# EasyEDA Pro project 遥控器PCB设计.eprj, schematic Schematic1
Board Name: 遥控器_4通道_完整版; Create Date: 2025-07-09; Page Name: P1; Project Name: 遥控器PCB设计; Schematic Name: Schematic1; Update Date: 2025-07-14; Company: 嘉立创EDA; Page Size: A4; Version: V1.0
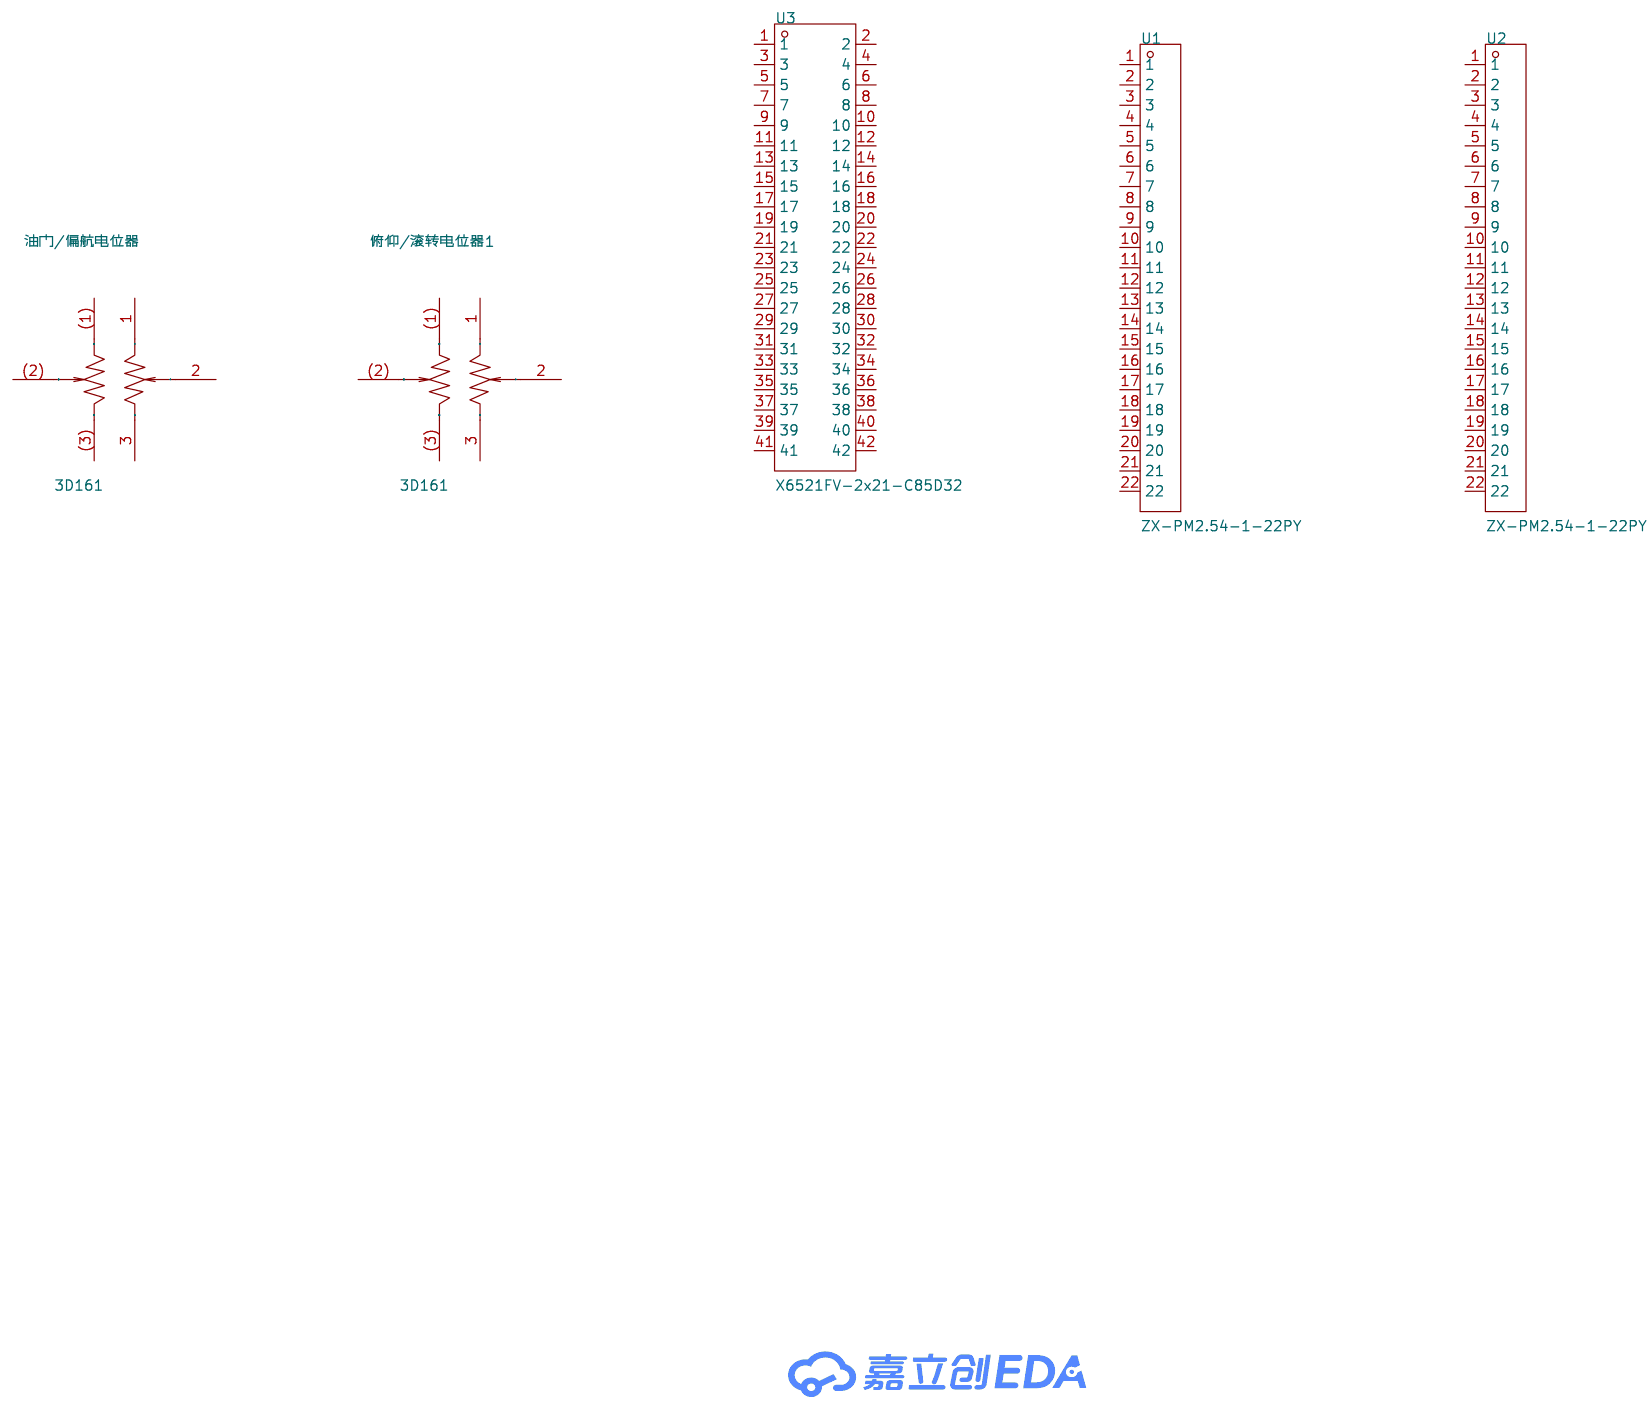
[diagram p8: schematic sheet]

## Parts
U1  ZX-PM2.54-1-22PY  [HDR-TH_22P-P2.54-V-F]
U2  ZX-PM2.54-1-22PY  [HDR-TH_22P-P2.54-V-F]
U3  X6521FV-2x21-C85D32  [HDR-TH_42P-P2.54-V-F-R2-C21-S2.54]
俯仰/滚转电位器1  3D161  [SW-TH_3D161]
油门/偏航电位器  3D161  [SW-TH_3D161]

## Library data of the parts
U1 U2 = ZX-PM2.54-1-22PY: LCSC Part Name: 1x22P 间距:2.54mm 直插; Supplier Part: C7499337; Manufacturer: Megastar(兆星); Supplier Footprint: 插件,P=2.54mm; JLCPCB Part Class: 扩展库; Datasheet: https://atta.szlcsc.com/upload/public/pdf/source/20231122/9A7AD1561672B326C4FDCF441604BC5A.pdf; Supplier: LCSC; Holes Structure: 1x22P; Pitch: 2.54mm; Circular Hole / Square Hole: 方孔; Mounting Type: 直插; Number of Rows: 单排; Number of Positions: 22P; Current Rating: 3A; Holes Direction: 顶部; Insulation Height: 8.5mm; Contact Plating: 金; Operating Temperature: -40℃~+105℃; PIN Length: 3.2mm
U3 = X6521FV-2X21-C85D32: 间距:2.54mm;总孔位数:42;排数:2;插孔结构:2x21P;行距:2.54mm;安装类型:直插;圆孔/方孔:方孔;额定电流:3A;额定电压:250V;插孔方向:顶部;塑高:8.5mm;触头材质:黄铜;触头镀层:金;工作温度范围:-40℃~+105℃;焊接温度(最大值):260℃;; LCSC Part Name: 2.54mm 2x21P; Supplier Part: C2883994; Manufacturer: XKB Connectivity(中国星坤); Supplier Footprint: 插件,P=2.54mm; Datasheet: https://atta.szlcsc.com/upload/public/pdf/source/20211009/C636DBF0733662F7F428F4420CCBBD46.pdf; Supplier: LCSC; Pitch: 2.54mm; Number of Holes: 42; Number of Rows: 2; Holes Structure: 2x21P; Row Spacing: 2.54mm; Mounting Type: 直插; Circular Hole / Square Hole: 方孔; Current Rating (Max): 3A; Voltage Rating (Max): 250V; Holes Direction: 顶部; Insulation Height: 8.5mm; Contact Material: 黄铜; Contact Plating: 金; Operating Temperature Range: -40℃~+105℃; Welding Temperature (Max): 260℃
俯仰/滚转电位器1 油门/偏航电位器 = 3D161: 摇杆  多向; LCSC Part Name: 3D161  3D摇杆 自恢复; Supplier Part: C92593; Manufacturer: 韩国韩荣; Supplier Footprint: 插件,16x16mm; JLCPCB Part Class: 扩展库; Datasheet: https://atta.szlcsc.com/upload/public/pdf/source/20170523/1495534045704.pdf; Supplier: LCSC

## Nets

Not connected (* = marked no-connect by the designer): U1 1 2 3 4 5 6 7 8 9 10 11 12 13 14 15 16 17 18 19 20 21 22; U2 1 2 3 4 5 6 7 8 9 10 11 12 13 14 15 16 17 18 19 20 21 22; U3 1 2 3 4 5 6 7 8 9 10 11 12 13 14 15 16 17 18 19 20 21 22 23 24 25 26 27 28 29 30 31 32 33 34 35 36 37 38 39 40 41 42; 俯仰/滚转电位器1 1 2 3 (1) (2) (3); 油门/偏航电位器 1 2 3 (1) (2) (3)
